# EAGLE design yamaHACK (EAGLE 9.2.2)
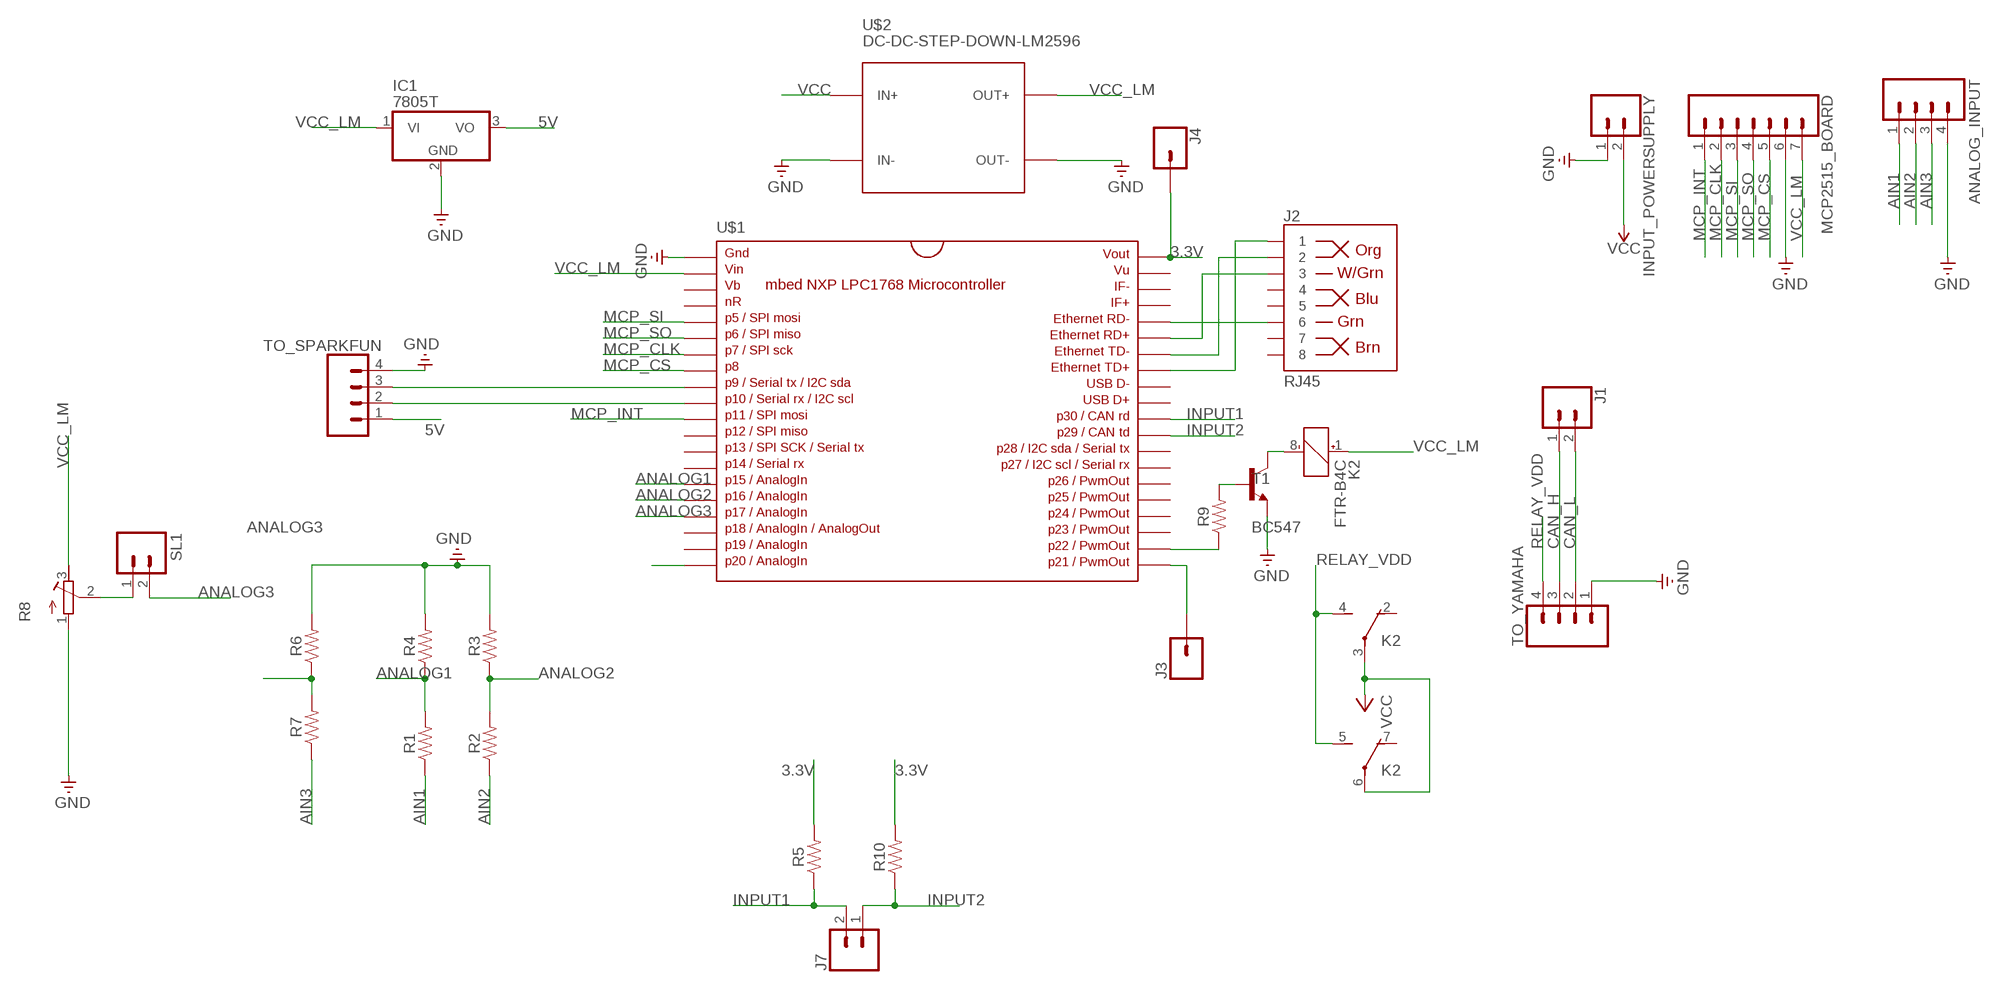
[diagram p0: schematic, sheet 1]

## Parts
ANALOG_INPUT  M04  [04P]
IC1  7805T  [TO220H]
INPUT_POWERSUPPLY  CONN_02PTH3  [1X02_LONGPADS]
J1  CONN_02  [1X02]
J2  RJ45  RJ45-8  [RJ45-8]
J3  CONN_01OFFSET  [1X01_OFFSET]
J4  CONN_01OFFSET  [1X01_OFFSET]
J7  CONN_02  [1X02]
K2  FTR-B4C  [FTR-B4C]
MCP2515_BOARD  CONN_07LONGPADS  [1X07_LONGPADS]
R1  RESISTORAXIAL-0.3  [AXIAL-0.3]
R2  RESISTORAXIAL-0.3  [AXIAL-0.3]
R3  RESISTORAXIAL-0.3  [AXIAL-0.3]
R4  RESISTORAXIAL-0.3  [AXIAL-0.3]
R5  RESISTORAXIAL-0.3  [AXIAL-0.3]
R6  RESISTORAXIAL-0.3  [AXIAL-0.3]
R7  RESISTORAXIAL-0.3  [AXIAL-0.3]
R8  R-TRIMM3296W  [RTRIM3296W]
R9  RESISTORAXIAL-0.3  [AXIAL-0.3]
R10  RESISTORAXIAL-0.3  [AXIAL-0.3]
SL1  M02  [02P]
T1  BC547  [TO92]
TO_SPARKFUN  CONN_04  [1X04]
TO_YAMAHA  CONN_04  [1X04]
U$1  MBED1768  MBED_NXP_LPC1768  [DIL40_0.9]
U$2  DC-DC-STEP-DOWN-LM2596  [DC-DC-STEP-DOWN-LM2596]

## Nets
3.3V: J4.1 R5.P$2 R10.P$2 U$1.40
5V: IC1.3(VO) TO_SPARKFUN.1
AIN1: ANALOG_INPUT.1 R1.P$1
AIN2: ANALOG_INPUT.2 R2.P$1
AIN3: ANALOG_INPUT.3 R7.P$1
ANALOG1: R1.P$2 R4.P$1 U$1.15
ANALOG2: R2.P$2 R3.P$1 U$1.16
ANALOG3: R6.P$1 R7.P$2 SL1.2 U$1.17
CAN_H: J1.1 TO_YAMAHA.3
CAN_L: J1.2 TO_YAMAHA.2
GND: ANALOG_INPUT.4 IC1.2(GND) INPUT_POWERSUPPLY.1 MCP2515_BOARD.6 R3.P$2 R4.P$2 R6.P$2 R8.1(A) T1.1(E) TO_SPARKFUN.4 TO_YAMAHA.1 U$1.1 U$2.IN- U$2.OUT-
INPUT1: J7.2 R5.P$1 U$1.30
INPUT2: J7.1 R10.P$1 U$1.29
MCP_CLK: MCP2515_BOARD.2 U$1.7
MCP_CS: MCP2515_BOARD.5 U$1.8
MCP_INT: MCP2515_BOARD.1 U$1.11
MCP_SI: MCP2515_BOARD.3 U$1.5
MCP_SO: MCP2515_BOARD.4 U$1.6
N$1: J3.1 U$1.21
N$3: U$1.20
N$4: R8.2(S) SL1.1
N$5: K2.8(K:-) T1.3(C)
N$6: R9.P$1 U$1.22
N$7: R9.P$2 T1.2(B)
N$9: J2.1 U$1.33
N$10: J2.2 U$1.34
N$11: J2.3 U$1.35
N$12: J2.6 U$1.36
N$14: TO_SPARKFUN.2 U$1.10
N$15: TO_SPARKFUN.3 U$1.9
RELAY_VDD: K2.4(-1:S) K2.5(-2:S) TO_YAMAHA.4
VCC: INPUT_POWERSUPPLY.2 K2.3(-1:P) K2.6(-2:P) U$2.IN+
VCC_LM: IC1.1(VI) K2.1(K:+) MCP2515_BOARD.7 R8.3(E) U$1.2 U$2.OUT+
Unconnected: J2.4 J2.5 J2.7 J2.8 K2.2(-1:O) K2.7(-2:O) U$1.3 U$1.4 U$1.12 U$1.13 U$1.14 U$1.18 U$1.19 U$1.23 U$1.24 U$1.25 U$1.26 U$1.27 U$1.28 U$1.31 U$1.32 U$1.37 U$1.38 U$1.39

## Library data of the parts
ANALOG_INPUT = con-amp-quick:M04: AMP QUICK CONNECTOR; OC_FARNELL: unknown; OC_NEWARK: unknown
IC1 = linear:78*: Positive VOLTAGE REGULATOR Source: http://cache.national.com/ds/LM/LM78L05.pdf http://www.fairchildsemi.com/ds/LM/LM7805.pdf
INPUT_POWERSUPPLY J1 J7 = SparkFun-Connectors:CONN_02: Multi connection point. Often used as Generic Header-pin footprint for 0.1 inch spaced/style header connections On any of the 0.1 inch spaced packages, you can populate with these: Break Away Headers - Straight <https://www.sparkfun.com/products/116> (PRT-00116) Break Away Male Headers - Right Angle <https://www.sparkfun.com/products/553> (PRT-00553) Female Headers <https://www.sparkfun.com/products/115> (PRT-00115) Break Away Headers - Machine Pin <https://www.sparkfun.com/products/117> (PRT-00117) Break Away Female Headers - Swiss Machine Pin <https://www.sparkfun.com/products/743> (PRT-00743) For SCREWTERMINALS and SPRING TERMINALS visit here: Screw Terimnals on SparkFun.com <https://www.sparkfun.com/search/results?term=Screw+Terminals> (5mm/3.5mm/2.54mm spacing) This device is also useful as a general connection point to wire up your design to another part of your project. Our various solder wires solder well into these plated through hole pads. Hook-Up Wire - Assortment (Stranded, 22 AWG) <https://www.sparkfun.com/products/11375> (PRT-11375) Hook-Up Wire - Assortment (Solid Core, 22 AWG) <https://www.sparkfun.com/products/11367> (PRT-11367) View the entire wire category on our website here <https://www.sparkfun.com/categories/141> Special notes: Molex polarized connector foot print use with: PRT-08233 with associated crimp pins and housings. 2.54_SCREWTERM for use with PRT-10571. 3.5mm Screw Terminal footprints for PRT-08084 5mm Screw Terminal footprints for use with PRT-08432
J2 = SparkFun-Connectors:RJ45-8: RJ45 Jack - 8 pin Simple RJ45, 8-pin connection. Commonly used for Cat5, Cat5e, and Cat6 Ethernet cables. Here is the connector we sell at SparkFun: RJ45 8-Pin Connector <https://www.sparkfun.com/products/643> (PRT-00643) Datasheet <https://cdn.sparkfun.com/datasheets/Prototyping/04908.pdf> It is used on this SparkFun product: SparkFun RJ45 Breakout <https://www.sparkfun.com/products/716> (BOB-00716) Note, you may also be interested in the "MAGJACK" version of this. It is basically a RJ45 connector, but also has some status LEDs built into the connector housing. You can check that out in this library at the device named "MAGJACK.dev" and see these products online: RJ45 Ethernet MagJack-Compatible <https://www.sparkfun.com/products/8534> (PRT-08534) SparkFun RJ45 MagJack Breakout <https://www.sparkfun.com/products/13021> (BOB-13021); PROD_ID: CONN-08506; SF_ID: PRT-00643
J3 J4 = SparkFun-Connectors:CONN_01: Single connection point. Often used as Generic Header-pin footprint for 0.1 inch spaced/style header connections On any of the 0.1 inch spaced packages, you can populate with these: Break Away Headers - Straight <https://www.sparkfun.com/products/116> (PRT-00116) Break Away Male Headers - Right Angle <https://www.sparkfun.com/products/553> (PRT-00553) Female Headers <https://www.sparkfun.com/products/115> (PRT-00115) Break Away Headers - Machine Pin <https://www.sparkfun.com/products/117> (PRT-00117) Break Away Female Headers - Swiss Machine Pin <https://www.sparkfun.com/products/743> (PRT-00743) This device is also useful as a general connection point to wire up your design to another part of your project. Our various solder wires solder well into these plated through hole pads. Hook-Up Wire - Assortment (Stranded, 22 AWG) <https://www.sparkfun.com/products/11375> (PRT-11375) Hook-Up Wire - Assortment (Solid Core, 22 AWG) <https://www.sparkfun.com/products/11367> (PRT-11367) View the entire wire category on our website here <https://www.sparkfun.com/categories/141> Special notes: SMTSO-256-ET is a "flush mount" nut for a 4-40 screw. We mostly use this on specialty testbeds; it is a nice way to connect hardware to your PCB at an adjustable hieght. Also note, the SNAP packages are for using a snappable style connector. We sell a baggie of snaps and they are also used on two LilyPad designs: Snap Assortment - 30 pack (male and female) <https://www.sparkfun.com/products/11347> (DEV-11347) LilyPad Arduino SimpleSnap <https://www.sparkfun.com/products/10941> (DEV-10941) LilyPad SimpleSnap Protoboard <https://www.sparkfun.com/products/10940> (DEV-10940)
K2 = relay:FTR-B4: ULTRA MINIATURE RELAY 2 POLES - 2 A (Slim Profile Signal Relay) FUJITSU FTR-B4 SERIES Source: FTR-B4.pdf
MCP2515_BOARD = SparkFun-Connectors:CONN_07: Multi connection point. Often used as Generic Header-pin footprint for 0.1 inch spaced/style header connections On any of the 0.1 inch spaced packages, you can populate with these: Break Away Headers - Straight <https://www.sparkfun.com/products/116> (PRT-00116) Break Away Male Headers - Right Angle <https://www.sparkfun.com/products/553> (PRT-00553) Female Headers <https://www.sparkfun.com/products/115> (PRT-00115) Break Away Headers - Machine Pin <https://www.sparkfun.com/products/117> (PRT-00117) Break Away Female Headers - Swiss Machine Pin <https://www.sparkfun.com/products/743> (PRT-00743) For SCREWTERMINALS and SPRING TERMINALS visit here: Screw Terimnals on SparkFun.com <https://www.sparkfun.com/search/results?term=Screw+Terminals> (5mm/3.5mm/2.54mm spacing) This device is also useful as a general connection point to wire up your design to another part of your project. Our various solder wires solder well into these plated through hole pads. Hook-Up Wire - Assortment (Stranded, 22 AWG) <https://www.sparkfun.com/products/11375> (PRT-11375) Hook-Up Wire - Assortment (Solid Core, 22 AWG) <https://www.sparkfun.com/products/11367> (PRT-11367) View the entire wire category on our website here <https://www.sparkfun.com/categories/141> Special notes: Molex polarized connector foot print use with SKU : PRT-08231 with associated crimp pins and housings. 1MM SMD Version SKU: PRT-10208 NOTES ON THE VARIANTS LOCK and LOCK_LONGPADS... This footprint was designed to help hold the alignment of a through-hole component (i.e. 6-pin header) while soldering it into place. You may notice that each hole has been shifted either up or down by 0.005 of an inch from it's more standard position (which is a perfectly straight line). This slight alteration caused the pins (the squares in the middle) to touch the edges of the holes. Because they are alternating, it causes a "brace" to hold the component in place. 0.005 has proven to be the perfect amount of "off-center" position when using our standard breakaway headers. Although looks a little odd when you look at the bare footprint, once you have a header in there, the alteration is very hard to notice. Also,if you push a header all the way into place, it is covered up entirely on the bottom side.
R1-R7 R9 R10 = SparkFun-Resistors:RESISTOR: Generic Resistor Package
R8 = resistor:R-TRIMM: Trimm resistor
SL1 = con-amp-quick:M02: AMP QUICK CONNECTOR; OC_FARNELL: unknown; OC_NEWARK: unknown
T1 = transistor:BC547: NPN TRANSISTOR
TO_SPARKFUN TO_YAMAHA = SparkFun-Connectors:CONN_04: Multi connection point. Often used as Generic Header-pin footprint for 0.1 inch spaced/style header connections On any of the 0.1 inch spaced packages, you can populate with these: Break Away Headers - Straight <https://www.sparkfun.com/products/116> (PRT-00116) Break Away Male Headers - Right Angle <https://www.sparkfun.com/products/553> (PRT-00553) Female Headers <https://www.sparkfun.com/products/115> (PRT-00115) Break Away Headers - Machine Pin <https://www.sparkfun.com/products/117> (PRT-00117) Break Away Female Headers - Swiss Machine Pin <https://www.sparkfun.com/products/743> (PRT-00743) For SCREWTERMINALS and SPRING TERMINALS visit here: Screw Terimnals on SparkFun.com <https://www.sparkfun.com/search/results?term=Screw+Terminals> (5mm/3.5mm/2.54mm spacing) This device is also useful as a general connection point to wire up your design to another part of your project. Our various solder wires solder well into these plated through hole pads. Hook-Up Wire - Assortment (Stranded, 22 AWG) <https://www.sparkfun.com/products/11375> (PRT-11375) Hook-Up Wire - Assortment (Solid Core, 22 AWG) <https://www.sparkfun.com/products/11367> (PRT-11367) View the entire wire category on our website here <https://www.sparkfun.com/categories/141> Special notes: Molex polarized connector foot print use with SKU : PRT-08231 with associated crimp pins and housings. 1MM SMD Version SKU: PRT-10208; PROD_ID: CONN-09696
U$1 = SparkFun-Boards:MBED_NXP_LPC1768: mbed LPC1768 board footprint Boards using this footprint: mbed - LPC1768 (Cortex-M3) (DEV-09564); PROD_ID: COMP-12167
U$2 = diy-modules:DC-DC-STEP-DOWN-LM2596: DC/DC Step-Down Regulator based on LM2596-ADJ chip LM2596 datasheet available here: http://www.ti.com/lit/ds/symlink/lm2596.pdf Click here to find device on ebay.com <http://www.ebay.com/sch/lm2596+power+regulator>

## Board
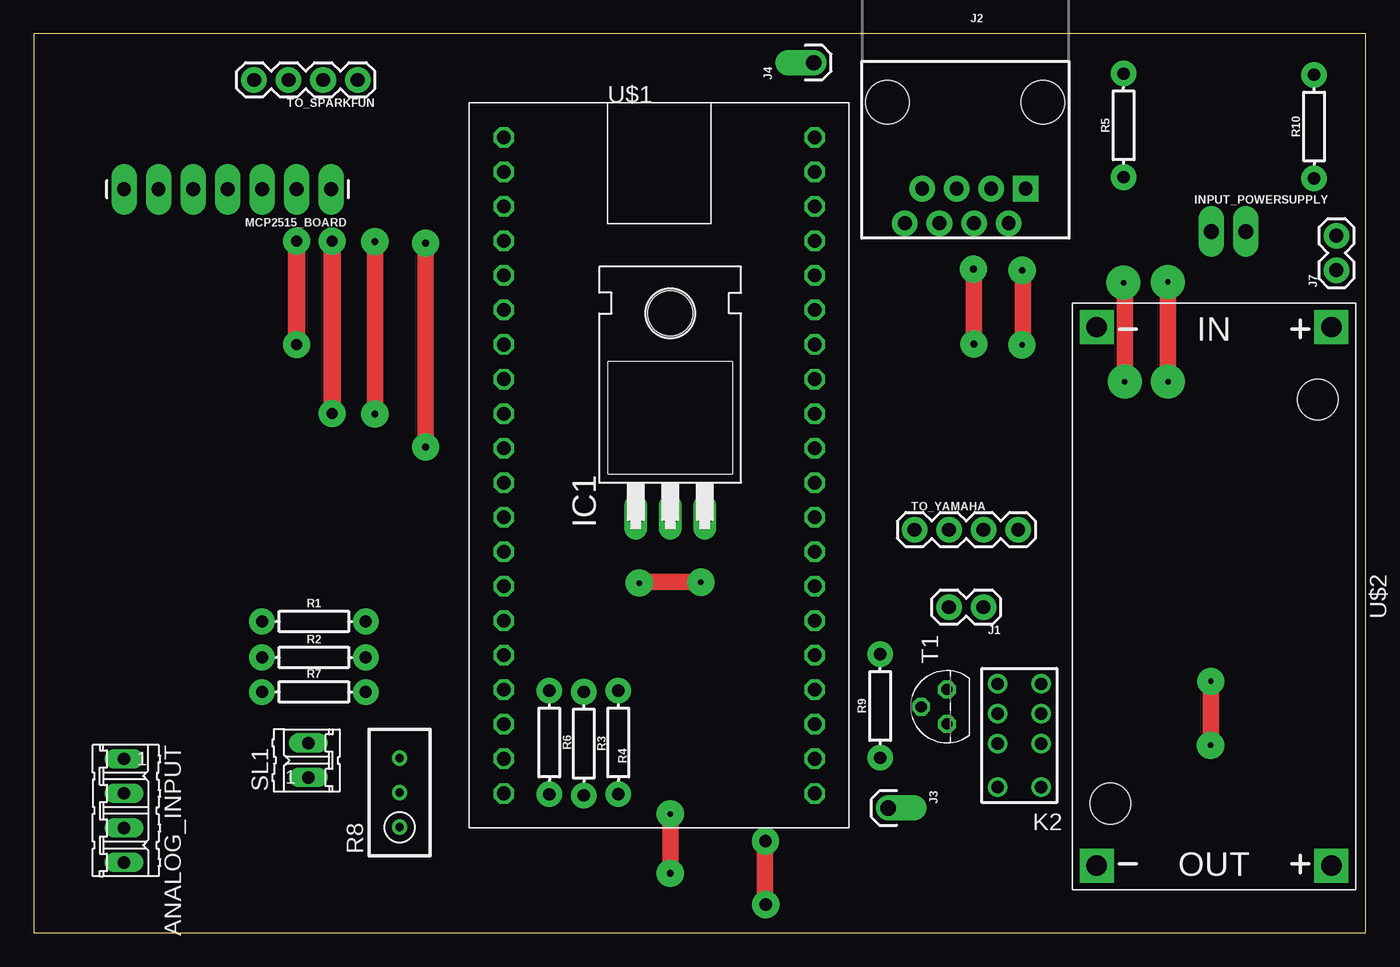
[diagram p1: board, top side]
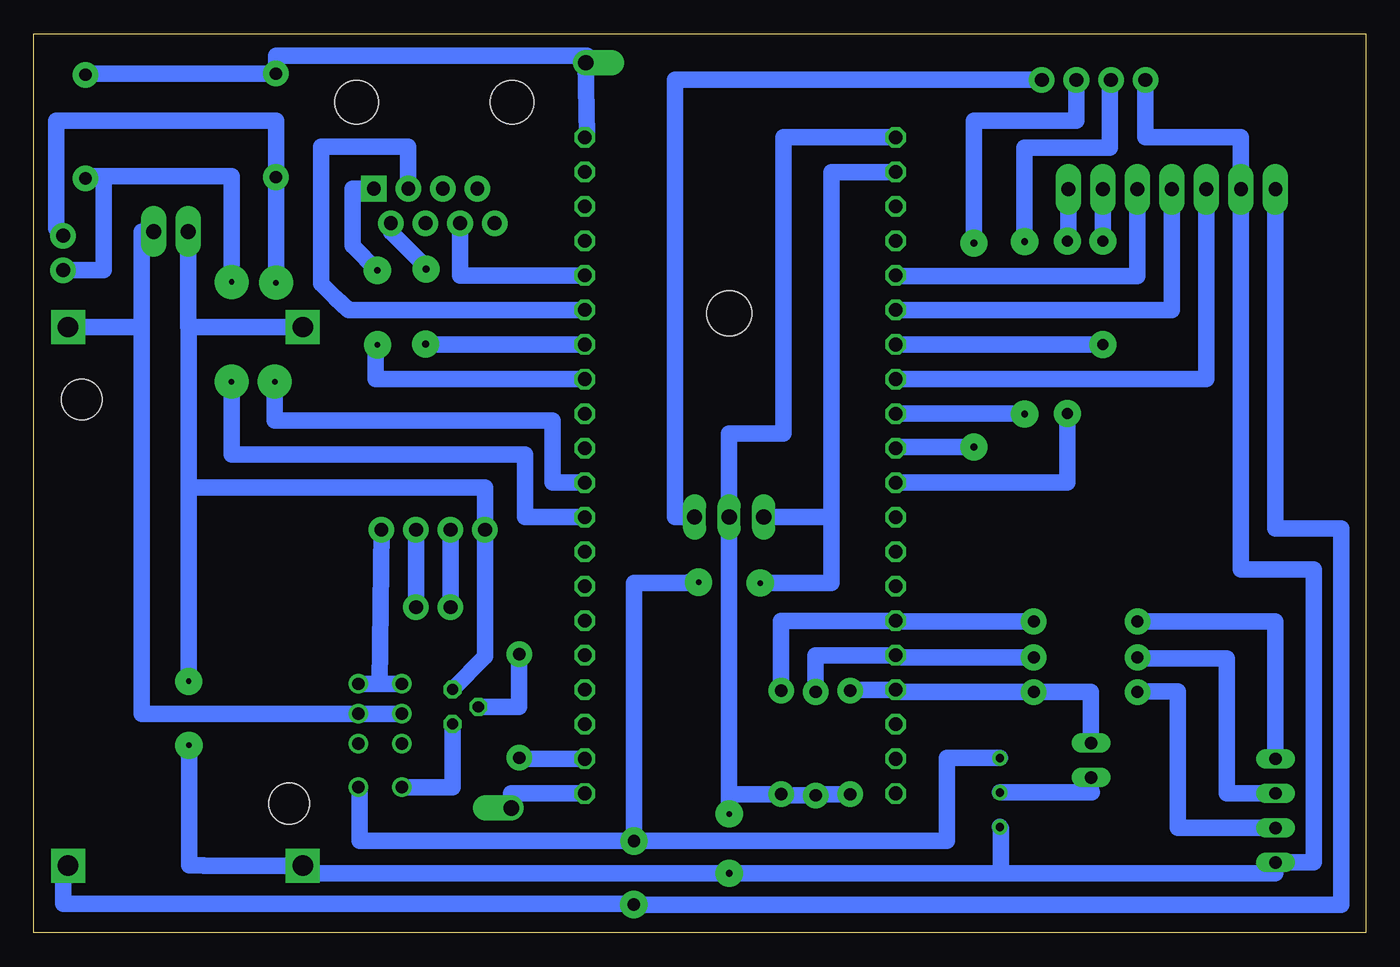
[diagram p2: board, bottom side, seen from below]

Size 97.95 x 66.11 mm. Coordinates in mm from the lower left corner, seen from the top.
Outline: 0,0 97.95,0 97.95,66.11 0,66.11 0,0
Copper layers (1*16): Top 0.035mm / dielectric 1.5mm / Bottom 0.035mm
Design rules "default *": minimum track width 6mil, minimum drill 0.35mm, track to track 0.2mm, track to pad 0.2mm, pad to pad 0.2mm, via to via 0.2mm, smd to smd 0.2mm, copper to edge 40mil, drill to drill 6mil, minimum pad ring 10mil, minimum via ring 8mil, stop-mask expansion 4mil, vias tented up to drill 0mil, thermal gap 10mil

### Footprints (pad centres in the part's own frame; a part is rotated, then mirrored left to right if it is on the bottom)
04P = drill 0.914 long: 1 -3.81,0; 2 -1.27,0; 3 1.27,0; 4 3.81,0
TO220H = drill 1.118 long: 1 -2.54,-10.16; 2 0,-10.16; 3 2.54,-10.16 | hole 3.302: 0,4.826
1X02_LONGPADS = drill 1.118 pad 1.88 long: 1 0,0; 2 2.54,0
1X02 = drill 1.016 pad 1.88: 1 0,0; 2 2.54,0
RJ45-8 = drill 1 pad 1.88 square: 1 -4.445,6.35 | drill 1 pad 1.88: 2 -3.175,8.89; 3 -1.905,6.35; 4 -0.635,8.89; 5 0.635,6.35; 6 1.905,8.89; 7 3.175,6.35; 8 4.445,8.89 | hole 3.2: -5.715,0; 5.715,0
1X01_OFFSET = drill 1.118 pad 1.88 offset: 1 0,0
FTR-B4C = drill 0.9 pad 1.422: 1 -3.8,-1.6; 2 -0.6,-1.6; 3 1.6,-1.6; 4 3.8,-1.6; 5 3.8,1.6; 6 1.6,1.6; 7 -0.6,1.6; 8 -3.8,1.6
1X07_LONGPADS = drill 1.016 pad 1.88 long: 1 0,0; 2 2.54,0; 3 5.08,0; 4 7.62,0; 5 10.16,0; 6 12.7,0; 7 15.24,0
AXIAL-0.3 = drill 0.9 pad 1.88: P$1 -3.81,0; P$2 3.81,0
RTRIM3296W = drill 0.61: 1 0,-2.54; 2 0,0; 3 0,2.54
02P = drill 0.914 long: 1 -1.27,0; 2 1.27,0
TO92 = drill 0.813 octagon: 1 1.27,0; 2 0,1.905; 3 -1.27,0
1X04 = drill 1.016 pad 1.88: 1 0,0; 2 2.54,0; 3 5.08,0; 4 7.62,0
DIL40_0.9 = drill 1 pad 1.397 octagon: 1 -22.86,-11.43; 2 -20.32,-11.43; 3 -17.78,-11.43; 4 -15.24,-11.43; 5 -12.7,-11.43; 6 -10.16,-11.43; 7 -7.62,-11.43; 8 -5.08,-11.43; 9 -2.54,-11.43; 10 0,-11.43; 11 2.54,-11.43; 12 5.08,-11.43; 13 7.62,-11.43; 14 10.16,-11.43; 15 12.7,-11.43; 16 15.24,-11.43; 17 17.78,-11.43; 18 20.32,-11.43; 19 22.86,-11.43; 20 25.4,-11.43; 21 25.4,11.43; 22 22.86,11.43; 23 20.32,11.43; 24 17.78,11.43; 25 15.24,11.43; 26 12.7,11.43; 27 10.16,11.43; 28 7.62,11.43; 29 5.08,11.43; 30 2.54,11.43; 31 0,11.43; 32 -2.54,11.43; 33 -5.08,11.43; 34 -7.62,11.43; 35 -10.16,11.43; 36 -12.7,11.43; 37 -15.24,11.43; 38 -17.78,11.43; 39 -20.32,11.43; 40 -22.86,11.43
DC-DC-STEP-DOWN-LM2596 = drill 1.5 pad 2.5 square: IN+ -19.812,8.636; IN- -19.812,-8.636; OUT+ 19.812,8.636; OUT- 19.812,-8.636 | hole 3: -14.478,7.62; 15.24,-7.62

### Placement (x,y rotation side)
ANALOG_INPUT  6.62,8.97 270 top
IC1  46.81,40.73 0 top
INPUT_POWERSUPPLY  86.6,51.57 0 top
J1  69.85,23.94 180 top
J2  68.51,61.08 180 top
J3  62.84,9.16 270 top
J4  57.36,64 90 top
J7  95.81,48.73 90 top
K2  72.49,14.5 90 top
MCP2515_BOARD  21.86,54.69 180 top
R1  20.59,22.89 0 top
R2  20.59,20.24 0 top
R3  40.45,13.9 270 top
R4  42.99,13.99 270 top
R5  80.15,59.39 90 top
R6  37.91,13.99 270 top
R7  20.59,17.7 0 top
R8  26.89,10.3 0 top
R9  62.24,16.67 90 top
R10  94.17,59.3 90 top
SL1  20.19,12.67 90 top
T1  67.17,16.62 90 top
TO_SPARKFUN  23.81,62.73 180 top
TO_YAMAHA  64.77,29.64 0 top
U$1  45.99,35.64 270 top
U$2  86.81,24.73 270 top

### Tracks (layer width: path | path; a pad name or v marks a point on that pad's centre or on a via)
3.3V
  Bottom 1.2: U$1.40 57.26,58.66 J4.1 57.26,64.49 80.15,64.49 R5.P$2 94.08,63.2 R10.P$2
5V
  Bottom 1.2: IC1.3 50.81,30.57 50.81,62.73 TO_SPARKFUN.1
AIN1
  Bottom 1.2: R1.P$1 6.62,22.89 ANALOG_INPUT.1
AIN2
  Bottom 1.2: ANALOG_INPUT.2 10.2,10.24 10.2,20.15 16.78,20.15 R2.P$1
AIN3
  Bottom 1.2: ANALOG_INPUT.3 13.81,7.7 13.81,17.73 16.81,17.73 16.81,17.7 R7.P$1
ANALOG1
  Bottom 1.2: R1.P$2 34.56,22.89 U$1.15 42.99,22.94 R4.P$1
ANALOG2
  Bottom 1.2: R2.P$2 34.56,20.24 U$1.16 40.45,20.4 R3.P$1
ANALOG3
  Bottom 1.2: SL1.2 20.19,17.7 R7.P$2 34.56,17.7 U$1.17 37.91,17.86 R6.P$1
CAN_H
  Bottom 1.2: TO_YAMAHA.3 J1.1
CAN_L
  Bottom 1.2: TO_YAMAHA.2 J1.2
GND  (via drill 0.4 pad 2, 0.5 pad 2)
  Top 1.2: v46.81,4.35 v46.81,8.73 | v86.57,18.49 86.57,13.78 v86.55,13.78
  Bottom 1.2: 86.5,44.54 U$2.IN- | IC1.2 46.83,30.55 | R6.P$2 40.36,10.18 R3.P$2 42.9,10.09 R4.P$2 46.45,10.18 46.81,10.54 | T1.1 64.75,20.3 64.75,32.73 64.77,32.73 | TO_SPARKFUN.4 16.19,58.5 9.16,58.5 MCP2515_BOARD.6 9.16,26.73 3.81,26.73 3.81,5.16 ANALOG_INPUT.4 6.62,4.37 26.81,4.37 | TO_YAMAHA.1 64.77,32.73 | U$1.1 42.81,58.5 42.81,36.73 46.81,36.73 IC1.2 | INPUT_POWERSUPPLY.1 86.6,44.54 86.57,44.54 86.57,32.73 | 86.57,32.73 v86.57,18.49 | 86.57,32.73 64.77,32.73 | 26.81,4.37 46.9,4.35 v46.81,4.35 47.08,4.37 78.17,4.37 U$2.OUT- 85.43,4.92 arc90 85.46,4.95 86.55,4.95 v86.55,13.78 | R8.1 26.81,7.68 26.81,4.37 | IC1.2 46.81,10.54 | v46.81,8.73 46.81,10.54
INPUT1  (via drill 0.4 pad 2.5)
  Top 1.2: v80.23,40.53 80.23,47.26 80.23,47.31 v80.15,47.81
  Bottom 1.2: U$1.30 59.81,33.1 59.81,37.69 80.25,37.69 80.23,37.8 v80.23,40.53 | R5.P$1 | R5.P$1 v80.15,47.81 | J7.2 96.33,51.78 96.33,59.73 80.15,59.73 R5.P$1
INPUT2  (via drill 0.4 pad 2.5)
  Top 1.2: v83.42,40.52 v83.42,47.86 v83.41,47.86
  Bottom 1.2: J7.1 92.81,48.73 92.81,55.49 R10.P$1 94.17,55.65 83.42,55.65 83.42,47.87 v83.41,47.86 | U$1.29 61.81,30.56 61.81,35.17 83.42,35.17 v83.42,40.52
MCP_CLK  (via drill 0.8 pad 2)
  Top 1.27: v19.32,50.88 v19.32,43.26
  Bottom 1.2: MCP2515_BOARD.2 v19.32,50.88 | v19.32,43.26 U$1.7
MCP_CS
  Bottom 1.2: MCP2515_BOARD.5 11.7,40.73 U$1.8
MCP_INT  (via drill 0.8 pad 2)
  Top 1.27: v21.94,50.88 v21.94,38.18
  Bottom 1.2: U$1.11 21.94,33.1 v21.94,38.18 | MCP2515_BOARD.1 21.86,50.88 v21.94,50.88
MCP_SI
  Bottom 1.2: MCP2515_BOARD.3 16.78,48.3 34.56,48.3 U$1.5
MCP_SO
  Bottom 1.2: MCP2515_BOARD.4 14.24,45.8 U$1.6
N$1
  Bottom 1.2: U$1.21 62.84,10.24 J3.1
N$4
  Bottom 1.2: R8.2 20.14,10.3 20.19,10.35 SL1.1
N$5
  Bottom 1.2: K2.8 67.17,10.7 T1.3
N$6
  Bottom 1.2: U$1.22 62.24,12.78 R9.P$1
N$7
  Bottom 1.2: T1.2 62.26,16.62 62.26,20.46 R9.P$2
N$9  (via drill 0.4 pad 2, 0.5 pad 2)
  Top 1.2: v72.69,48.72 72.76,48.65 72.76,43.32 v72.68,43.24
  Bottom 1.2: U$1.33 72.81,40.73 72.81,43.11 v72.68,43.24 | J2.1 74.5,54.74 74.5,50.53 v72.69,48.72
N$10  (via drill 0.5 pad 2)
  Top 1.2: v69.11,48.8 69.15,48.77 v69.15,43.3
  Bottom 1.2: U$1.34 69.15,43.26 v69.15,43.3 | J2.2 71.69,51.54 69.26,49.11 69.26,48.95 v69.11,48.8
N$11
  Bottom 1.2: U$1.35 74.81,45.8 75.81,46.73 76.81,47.73 76.81,57.83 70.42,57.83 J2.3
N$12
  Bottom 1.2: U$1.36 66.61,48.34 J2.6
N$14  (via drill 0.5 pad 2)
  Top 1.2: v28.81,35.73 v28.81,50.73
  Bottom 1.2: U$1.10 34.56,35.73 v28.81,35.73 | v28.81,50.73 28.81,59.73 21.27,59.73 TO_SPARKFUN.2
N$15  (via drill 0.5 pad 2)
  Top 1.2: v25.08,38.14 v25.08,50.83
  Bottom 1.2: U$1.9 25.08,38.18 v25.08,38.14 | v25.08,50.83 25.08,57.73 18.81,57.73 18.81,62.73 TO_SPARKFUN.3
RELAY_VDD
  Bottom 1.2: K2.5 K2.4 72.51,18.31 TO_YAMAHA.4
VCC
  Bottom 1.2: INPUT_POWERSUPPLY.2 90.04,51.57 90.04,44.54 | 90.04,44.54 U$2.IN+ | 90.04,44.54 90.04,16.1 K2.3 K2.6
VCC_LM  (via drill 0.4 pad 2, 0.9 pad 2)
  Top 1.2: v53.81,6.73 53.77,6.69 53.77,2.11 v53.82,2.06 | v44.53,25.71 44.59,25.78 v49.06,25.78
  Bottom 1.2: 6.62,54.73 MCP2515_BOARD.7 6.62,29.73 1.78,29.73 1.78,2.03 53.8,2.03 v53.82,2.06 53.87,2.11 95.81,2.11 95.81,4.92 U$2.OUT+ | v53.81,6.73 74.01,6.73 74.01,10.7 K2.1 | 39.27,30.57 39.27,25.73 44.52,25.73 v44.53,25.71 | v53.81,6.73 53.81,25.73 49.81,25.73 49.76,25.78 v49.06,25.78 | R8.3 30.81,12.84 30.81,6.73 v53.81,6.73 | U$1.2 39.27,55.96 39.27,30.57 | 39.27,30.57 IC1.1